# Altium project OPENMV3.PrjPcb
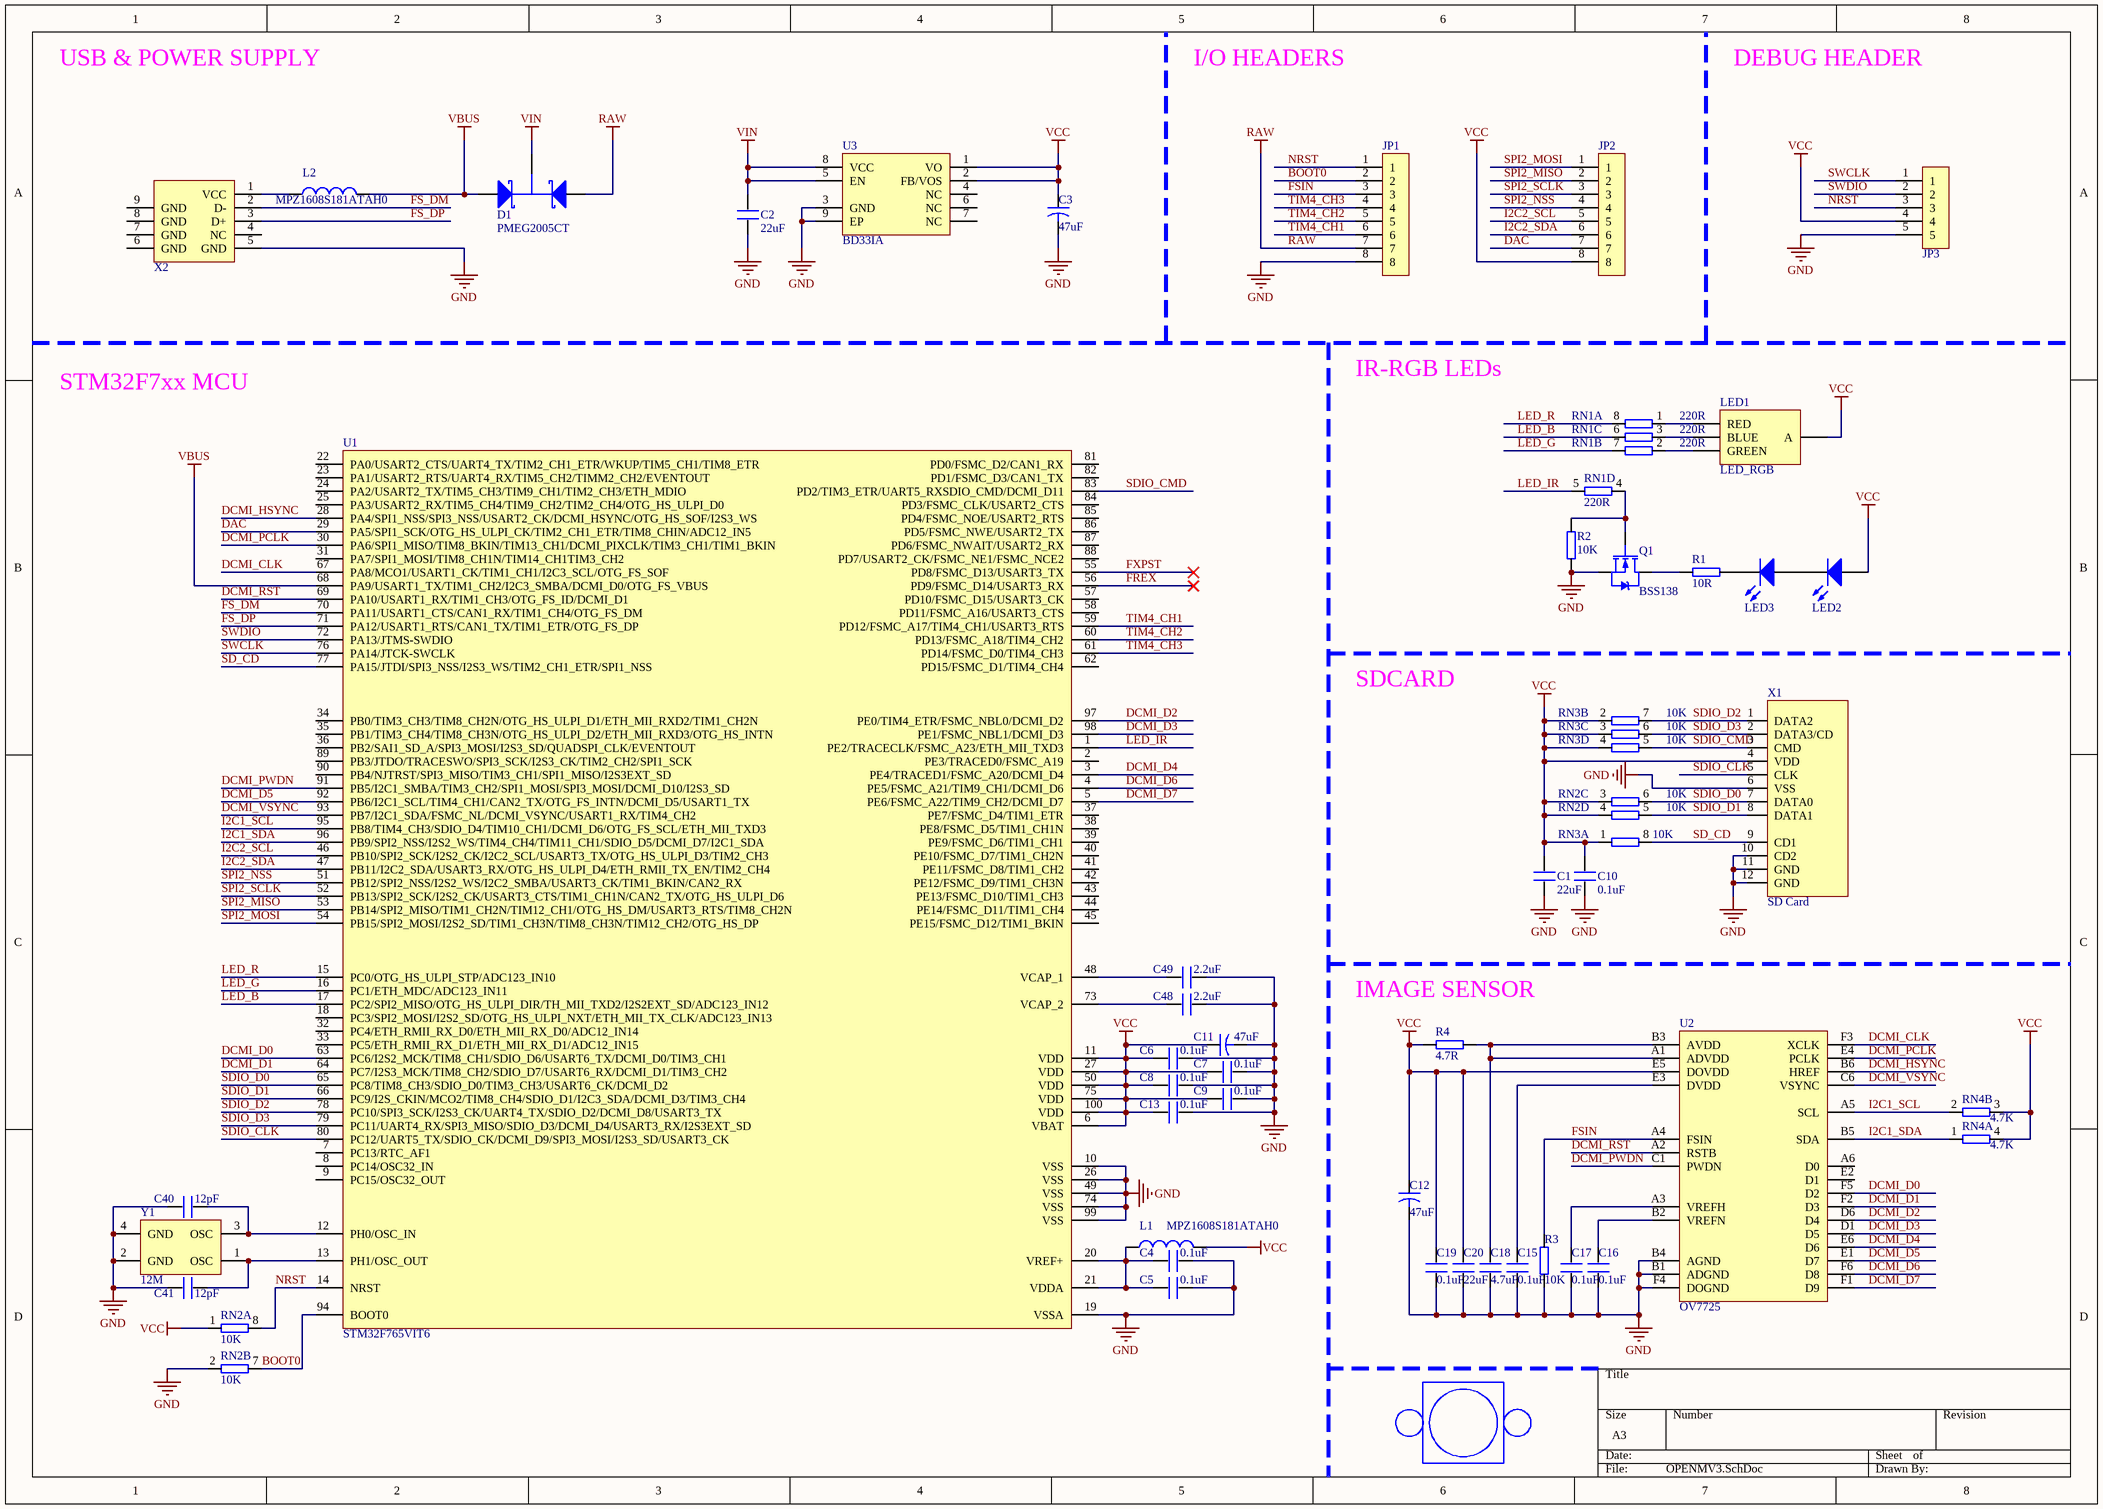
[diagram p0: OPENMV3.SchDoc]
1 sheet, 48 parts. Net scope: global (net labels, ports and power ports of the same name join across sheets).
Board file: OpenMV Cam M7.PcbDoc

## Sheet OPENMV3.SchDoc
size A3

### Parts
C1  value 22uF  [C0603]  (hidden comment: CAP)
C2  value 22uF  [C0603]  (hidden comment: CAP)
C3  value 47uF  [CAP-A]  (hidden comment: CAP)
C4  value 0.1uF  [C0603]  (hidden comment: CAP)
C5  value 0.1uF  [C0603]  (hidden comment: CAP)
C6  value 0.1uF  [C0603]  (hidden comment: CAP)
C7  value 0.1uF  [C0603]  (hidden comment: CAP)
C8  value 0.1uF  [C0603]  (hidden comment: CAP)
C9  value 0.1uF  [C0603]  (hidden comment: CAP)
C10  value 0.1uF  [C0603]  (hidden comment: CAP)
C11  value 47uF  [CAP-A]  (hidden comment: CAP)
C12  value 47uF  [CAP-A]  (hidden comment: CAP)
C13  value 0.1uF  [C0603]  (hidden comment: CAP)
C15  value 0.1uF  [C0603]  (hidden comment: CAP)
C16  value 0.1uF  [C0603]  (hidden comment: CAP)
C17  value 0.1uF  [C0603]  (hidden comment: CAP)
C18  value 4.7uF  [C0603]  (hidden comment: CAP)
C19  value 0.1uF  [C0603]  (hidden comment: CAP)
C20  value 22uF  [C0603]  (hidden comment: CAP)
C40  value 12pF  [C0603]  (hidden comment: CAP)
C41  value 12pF  [C0603]  (hidden comment: CAP)
C48  value 2.2uF  [C0603]  (hidden comment: CAP)
C49  value 2.2uF  [C0603]  (hidden comment: CAP)
D1  PMEG2005CT  [SOT-23]
JP1  HEADER1*8  [HEADER1*8_oct]  (value not drawn)
JP2  HEADER1*8  [HEADER1*8_oct]  (value not drawn)
JP3  HEADER1*5  [HEADER1*5_oct]  (value not drawn)
L1  value MPZ1608S181ATAH0  [R0603]  (hidden comment: Inductance)
L2  value MPZ1608S181ATAH0  [R0603]  (hidden comment: Inductance)
LED1  LED_RGB  [LED_RGB_3528]
LED2  LED  [LED1206]  (value not drawn)
LED3  LED  [LED1206]  (value not drawn)
P0  CameraLens  [CamLens_M12-2016]  (value not drawn)
Q1  BSS138  [sot-23]
R1  value 10R  [R0603]  (hidden comment: Resistor)
R2  value 10K  [R0603]  (hidden comment: Resistor)
R3  value 10K  [R0603]  (hidden comment: Resistor)
R4  value 4.7R  [R0603]  (hidden comment: Resistor)
RN1  value 220R  [R0603_x4]  (hidden comment: Res)  (parts A,B,C,D of 4)
RN2  value 10K  [R0603_x4]  (hidden comment: Res)  (parts A,B,C,D of 4)
RN3  value 10K  [R0603_x4]  (hidden comment: Res)  (parts A,B,C,D of 4)
RN4  value 4.7K  [R0603_x2]  (hidden comment: Res)  (parts A,B of 2)
U1  STM32F765VIT6  [LQFP100]
U2  OV7725  [BGA28C80P6X6_535X535X96]
U3  BD33IA  [SOIC8-HS]
X1  SD Card  [SD_Slot]
X2  USB  [MicroUSB_5P_2h]  (value not drawn)
Y1  value 12M  [XTAL-3225]  (hidden comment: Crystal)

### Nets
GND: C1.1 C2.1 C3.1 C4.2 C5.2 C6.2 C7.2 C8.2 C9.2 C10.1 C11.1 C12.1 C13.2 C15.1 C16.1 C17.1 C18.1 C19.1 C20.1 C40.2 C41.2 C48.1 C49.1 JP1.8 JP3.5 Q1.2(S) R2.1 R3.1 RN2.2 U1.10(VSS) U1.19(VSSA) U1.26(VSS) U1.49(VSS) U1.74(VSS) U1.99(VSS) U2.B1(ADGND) U2.B4(AGND) U2.F4(DOGND) U3.3(GND) U3.9(EP) X1.6(VSS) X1.10(CD2) X1.11(GND) X1.12(GND) X2.5(GND) Y1.2(GND) Y1.4(GND)
RAW: D1.1 JP1.7
VBUS: D1.2 L2.2 U1.68(PA9/USART1_TX/TIM1_CH2/I2C3_SMBA/DCMI_D0/OTG_FS_VBUS)
VCC: C1.2 C3.2 C6.1 C7.1 C8.1 C9.1 C10.2 C11.2 C12.2 C13.1 C19.2 C20.2 JP2.8 JP3.4 L1.2 LED1.2(A) LED2.1(A) R4.2 RN2.1 RN2.3 RN2.4 RN3.1 RN3.2 RN3.3 RN3.4 RN4.3 RN4.4 U1.6(VBAT) U1.11(VDD) U1.27(VDD) U1.50(VDD) U1.75(VDD) U1.100(VDD) U2.E5(DOVDD) U3.1(VO) U3.2(FB/VOS) X1.4(VDD)
VIN: C2.2 D1.3 U3.5(EN) U3.8(VCC)
BOOT0: JP1.2 RN2.7 U1.94(BOOT0)
DAC: JP2.7 U1.29(PA5/SPI1_SCK/OTG_HS_ULPI_CK/TIM2_CH1_ETR/TIM8_CHIN/ADC12_IN5)
DCMI_CLK: U1.67(PA8/MCO1/USART1_CK/TIM1_CH1/I2C3_SCL/OTG_FS_SOF) U2.F3(XCLK)
DCMI_D0: U1.63(PC6/I2S2_MCK/TIM8_CH1/SDIO_D6/USART6_TX/DCMI_D0/TIM3_CH1) U2.F5(D2)
DCMI_D1: U1.64(PC7/I2S3_MCK/TIM8_CH2/SDIO_D7/USART6_RX/DCMI_D1/TIM3_CH2) U2.F2(D3)
DCMI_D2: U1.97(PE0/TIM4_ETR/FSMC_NBL0/DCMI_D2) U2.D6(D4)
DCMI_D3: U1.98(PE1/FSMC_NBL1/DCMI_D3) U2.D1(D5)
DCMI_D4: U1.3(PE4/TRACED1/FSMC_A20/DCMI_D4) U2.E6(D6)
DCMI_D5: U1.92(PB6/I2C1_SCL/TIM4_CH1/CAN2_TX/OTG_FS_INTN/DCMI_D5/USART1_TX) U2.E1(D7)
DCMI_D6: U1.4(PE5/FSMC_A21/TIM9_CH1/DCMI_D6) U2.F6(D8)
DCMI_D7: U1.5(PE6/FSMC_A22/TIM9_CH2/DCMI_D7) U2.F1(D9)
DCMI_HSYNC: U1.28(PA4/SPI1_NSS/SPI3_NSS/USART2_CK/DCMI_HSYNC/OTG_HS_SOF/I2S3_WS) U2.B6(HREF)
DCMI_PCLK: U1.30(PA6/SPI1_MISO/TIM8_BKIN/TIM13_CH1/DCMI_PIXCLK/TIM3_CH1/TIM1_BKIN) U2.E4(PCLK)
DCMI_PWDN: U1.91(PB5/I2C1_SMBA/TIM3_CH2/SPI1_MOSI/SPI3_MOSI/DCMI_D10/I2S3_SD) U2.C1(PWDN)
DCMI_RST: U1.69(PA10/USART1_RX/TIM1_CH3/OTG_FS_ID/DCMI_D1) U2.A2(RSTB)
DCMI_VSYNC: U1.93(PB7/I2C1_SDA/FSMC_NL/DCMI_VSYNC/USART1_RX/TIM4_CH2) U2.C6(VSYNC)
FREX: U1.56(PD9/FSMC_D14/USART3_RX)
FS_DM: U1.70(PA11/USART1_CTS/CAN1_RX/TIM1_CH4/OTG_FS_DM) X2.2(D-)
FS_DP: U1.71(PA12/USART1_RTS/CAN1_TX/TIM1_ETR/OTG_FS_DP) X2.3(D+)
FSIN: JP1.3 R3.2 U2.A4(FSIN)
FXPST: U1.55(PD8/FSMC_D13/USART3_TX)
I2C1_SCL: RN4.2 U1.95(PB8/TIM4_CH3/SDIO_D4/TIM10_CH1/DCMI_D6/OTG_FS_SCL/ETH_MII_TXD3) U2.A5(SCL)
I2C1_SDA: RN4.1 U1.96(PB9/SPI2_NSS/I2S2_WS/TIM4_CH4/TIM11_CH1/SDIO_D5/DCMI_D7/I2C1_SDA) U2.B5(SDA)
I2C2_SCL: JP2.5 U1.46(PB10/SPI2_SCK/I2S2_CK/I2C2_SCL/USART3_TX/OTG_HS_ULPI_D3/TIM2_CH3)
I2C2_SDA: JP2.6 U1.47(PB11/I2C2_SDA/USART3_RX/OTG_HS_ULPI_D4/ETH_RMII_TX_EN/TIM2_CH4)
LED_B: RN1.6 U1.17(PC2/SPI2_MISO/OTG_HS_ULPI_DIR/TH_MII_TXD2/I2S2EXT_SD/ADC123_IN12)
LED_G: RN1.7 U1.16(PC1/ETH_MDC/ADC123_IN11)
LED_IR: RN1.5 U1.1(PE2/TRACECLK/FSMC_A23/ETH_MII_TXD3)
LED_R: RN1.8 U1.15(PC0/OTG_HS_ULPI_STP/ADC123_IN10)
NRST: JP1.1 JP3.3 RN2.8 U1.14(NRST)
SD_CD: RN3.8 U1.77(PA15/JTDI/SPI3_NSS/I2S3_WS/TIM2_CH1_ETR/SPI1_NSS) X1.9(CD1)
SDIO_CLK: U1.80(PC12/UART5_TX/SDIO_CK/DCMI_D9/SPI3_MOSI/I2S3_SD/USART3_CK) X1.5(CLK)
SDIO_CMD: RN3.5 U1.83(PD2/TIM3_ETR/UART5_RXSDIO_CMD/DCMI_D11) X1.3(CMD)
SDIO_D0: RN2.6 U1.65(PC8/TIM8_CH3/SDIO_D0/TIM3_CH3/USART6_CK/DCMI_D2) X1.7(DATA0)
SDIO_D1: RN2.5 U1.66(PC9/I2S_CKIN/MCO2/TIM8_CH4/SDIO_D1/I2C3_SDA/DCMI_D3/TIM3_CH4) X1.8(DATA1)
SDIO_D2: RN3.7 U1.78(PC10/SPI3_SCK/I2S3_CK/UART4_TX/SDIO_D2/DCMI_D8/USART3_TX) X1.1(DATA2)
SDIO_D3: RN3.6 U1.79(PC11/UART4_RX/SPI3_MISO/SDIO_D3/DCMI_D4/USART3_RX/I2S3EXT_SD) X1.2(DATA3/CD)
SPI2_MISO: JP2.2 U1.53(PB14/SPI2_MISO/TIM1_CH2N/TIM12_CH1/OTG_HS_DM/USART3_RTS/TIM8_CH2N)
SPI2_MOSI: JP2.1 U1.54(PB15/SPI2_MOSI/I2S2_SD/TIM1_CH3N/TIM8_CH3N/TIM12_CH2/OTG_HS_DP)
SPI2_NSS: JP2.4 U1.51(PB12/SPI2_NSS/I2S2_WS/I2C2_SMBA/USART3_CK/TIM1_BKIN/CAN2_RX)
SPI2_SCLK: JP2.3 U1.52(PB13/SPI2_SCK/I2S2_CK/USART3_CTS/TIM1_CH1N/CAN2_TX/OTG_HS_ULPI_D6)
SWCLK: JP3.1 U1.76(PA14/JTCK-SWCLK)
SWDIO: JP3.2 U1.72(PA13/JTMS-SWDIO)
TIM4_CH1: JP1.6 U1.59(PD12/FSMC_A17/TIM4_CH1/USART3_RTS)
TIM4_CH2: JP1.5 U1.60(PD13/FSMC_A18/TIM4_CH2)
TIM4_CH3: JP1.4 U1.61(PD14/FSMC_D0/TIM4_CH3)
NetC4_1: C4.1 C5.1 L1.1 U1.20(VREF+) U1.21(VDDA)
NetC15_2: C15.2 U2.E3(DVDD)
NetC16_2: C16.2 U2.B2(VREFN)
NetC17_2: C17.2 U2.A3(VREFH)
NetC18_2: C18.2 R4.1 U2.A1(ADVDD) U2.B3(AVDD)
NetC40_1: C40.1 U1.12(PH0/OSC_IN) Y1.3(OSC)
NetC41_1: C41.1 U1.13(PH1/OSC_OUT) Y1.1(OSC)
NetC48_2: C48.2 U1.73(VCAP_2)
NetC49_2: C49.2 U1.48(VCAP_1)
NetL2_1: L2.1 X2.1(VCC)
NetLED1_1: LED1.1(RED) RN1.1
NetLED1_3: LED1.3(BLUE) RN1.3
NetLED1_4: LED1.4(GREEN) RN1.2
NetLED2_2: LED2.2(K) LED3.1(A)
NetLED3_2: LED3.2(K) R1.1
NetQ1_1: Q1.1(G) R2.2 RN1.4
NetQ1_3: Q1.3(D) R1.2

Not connected (* = marked no-connect by the designer): U1 2(PE3/TRACED0/FSMC_A19) 7(PC13/RTC_AF1) 8(PC14/OSC32_IN) 9(PC15/OSC32_OUT) 18(PC3/SPI2_MOSI/I2S2_SD/OTG_HS_ULPI_NXT/ETH_MII_TX_CLK/ADC123_IN13) 22(PA0/USART2_CTS/UART4_TX/TIM2_CH1_ETR/WKUP/TIM5_CH1/TIM8_ETR) 23(PA1/USART2_RTS/UART4_RX/TIM5_CH2/TIMM2_CH2/EVENTOUT) 24(PA2/USART2_TX/TIM5_CH3/TIM9_CH1/TIM2_CH3/ETH_MDIO) 25(PA3/USART2_RX/TIM5_CH4/TIM9_CH2/TIM2_CH4/OTG_HS_ULPI_D0) 31(PA7/SPI1_MOSI/TIM8_CH1N/TIM14_CH1TIM3_CH2) 32(PC4/ETH_RMII_RX_D0/ETH_MII_RX_D0/ADC12_IN14) 33(PC5/ETH_RMII_RX_D1/ETH_MII_RX_D1/ADC12_IN15) 34(PB0/TIM3_CH3/TIM8_CH2N/OTG_HS_ULPI_D1/ETH_MII_RXD2/TIM1_CH2N) 35(PB1/TIM3_CH4/TIM8_CH3N/OTG_HS_ULPI_D2/ETH_MII_RXD3/OTG_HS_INTN) 36(PB2/SAI1_SD_A/SPI3_MOSI/I2S3_SD/QUADSPI_CLK/EVENTOUT) 37(PE7/FSMC_D4/TIM1_ETR) 38(PE8/FSMC_D5/TIM1_CH1N) 39(PE9/FSMC_D6/TIM1_CH1) 40(PE10/FSMC_D7/TIM1_CH2N) 41(PE11/FSMC_D8/TIM1_CH2) 42(PE12/FSMC_D9/TIM1_CH3N) 43(PE13/FSMC_D10/TIM1_CH3) 44(PE14/FSMC_D11/TIM1_CH4) 45(PE15/FSMC_D12/TIM1_BKIN) 57(PD10/FSMC_D15/USART3_CK) 58(PD11/FSMC_A16/USART3_CTS) 62(PD15/FSMC_D1/TIM4_CH4) 81(PD0/FSMC_D2/CAN1_RX) 82(PD1/FSMC_D3/CAN1_TX) 84(PD3/FSMC_CLK/USART2_CTS) 85(PD4/FSMC_NOE/USART2_RTS) 86(PD5/FSMC_NWE/USART2_TX) 87(PD6/FSMC_NWAIT/USART2_RX) 88(PD7/USART2_CK/FSMC_NE1/FSMC_NCE2) 89(PB3/JTDO/TRACESWO/SPI3_SCK/I2S3_CK/TIM2_CH2/SPI1_SCK) 90(PB4/NJTRST/SPI3_MISO/TIM3_CH1/SPI1_MISO/I2S3EXT_SD); U2 A6(D0) E2(D1); U3 4(NC) 6(NC) 7(NC); X2 4(NC) 6(GND) 7(GND) 8(GND) 9(GND)

### Notes on the sheet
- USB & POWER SUPPLY
- I/O HEADERS
- DEBUG HEADER
- IR-RGB LEDs
- STM32F7xx MCU
- SDCARD
- (near R4) IMAGE SENSOR

### Library data of the parts
C1 C2 C4-C10 C13 C15-C20 C40 C41 C48 C49 = C
C3 C11 C12 = CAP-B
D1 = D_Double
L1 L2 = L
Q1 = AO3402
R1-R4 = R
RN1-RN3 = RES-Pack4
RN4 = RES-Pack2
X1 = SD_Slot
Y1 = 无源晶振